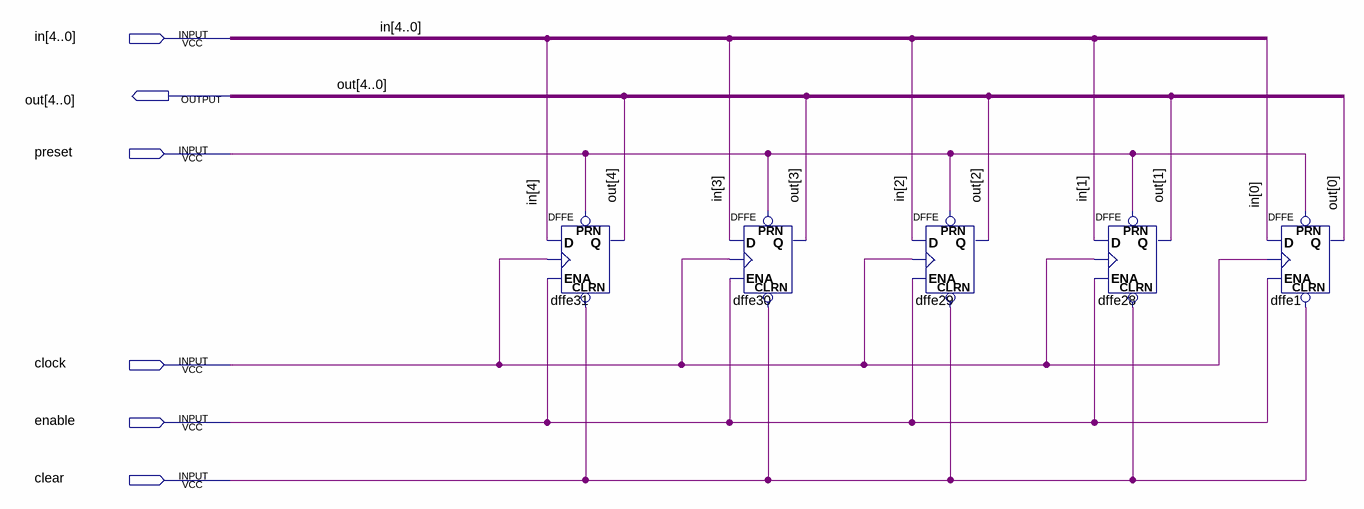
[diagram p0: schematic sheet]
// Quartus schematic reg5bits.bdf as structural Verilog: 5 symbols, 6 pins
module reg5bits (
  input  [4:0] in,
  input  preset,
  input  clock,
  input  enable,
  input  clear,
  output [4:0] out
);

  DFFE dffe31 (.PRN(preset), .CLRN(clear), .D(in[4]), .CLK(clock), .ENA(enable), .Q(out[4]));
  DFFE dffe30 (.PRN(preset), .CLRN(clear), .D(in[3]), .CLK(clock), .ENA(enable), .Q(out[3]));
  DFFE dffe29 (.PRN(preset), .CLRN(clear), .D(in[2]), .CLK(clock), .ENA(enable), .Q(out[2]));
  DFFE dffe28 (.PRN(preset), .CLRN(clear), .D(in[1]), .CLK(clock), .ENA(enable), .Q(out[1]));
  DFFE dffe1 (.PRN(preset), .CLRN(clear), .D(in[0]), .CLK(clock), .ENA(enable), .Q(out[0]));
endmodule
